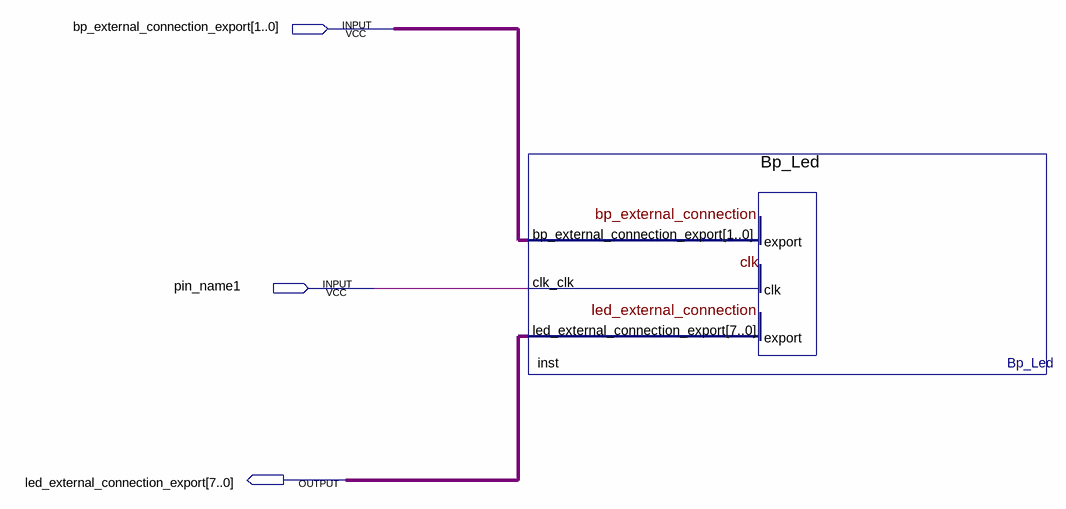
[diagram p0: schematic sheet]
// Quartus schematic LED.bdf as structural Verilog: 1 symbols, 3 pins
module LED (
  input  [1:0] bp_external_connection_export,
  input  pin_name1,
  output [7:0] led_external_connection_export
);

  Bp_Led inst (
    .bp_external_connection_export(bp_external_connection_export), .clk_clk(pin_name1),
    .led_external_connection_export(led_external_connection_export));
endmodule
